# Altium schematic sheet PWRCTRL_RELAY_PWM_48V3A.SchDoc: Device Control Port
size A4; Organization: Altium Limited.; Address1: Level 3, 12a Rodborough Rd; Address2: Frenchs Forest 2086; Address3: NSW; Address4: AUSTRALIA; DocumentNumber: 1; Revision: 6; SheetNumber: 1; SheetTotal: 2
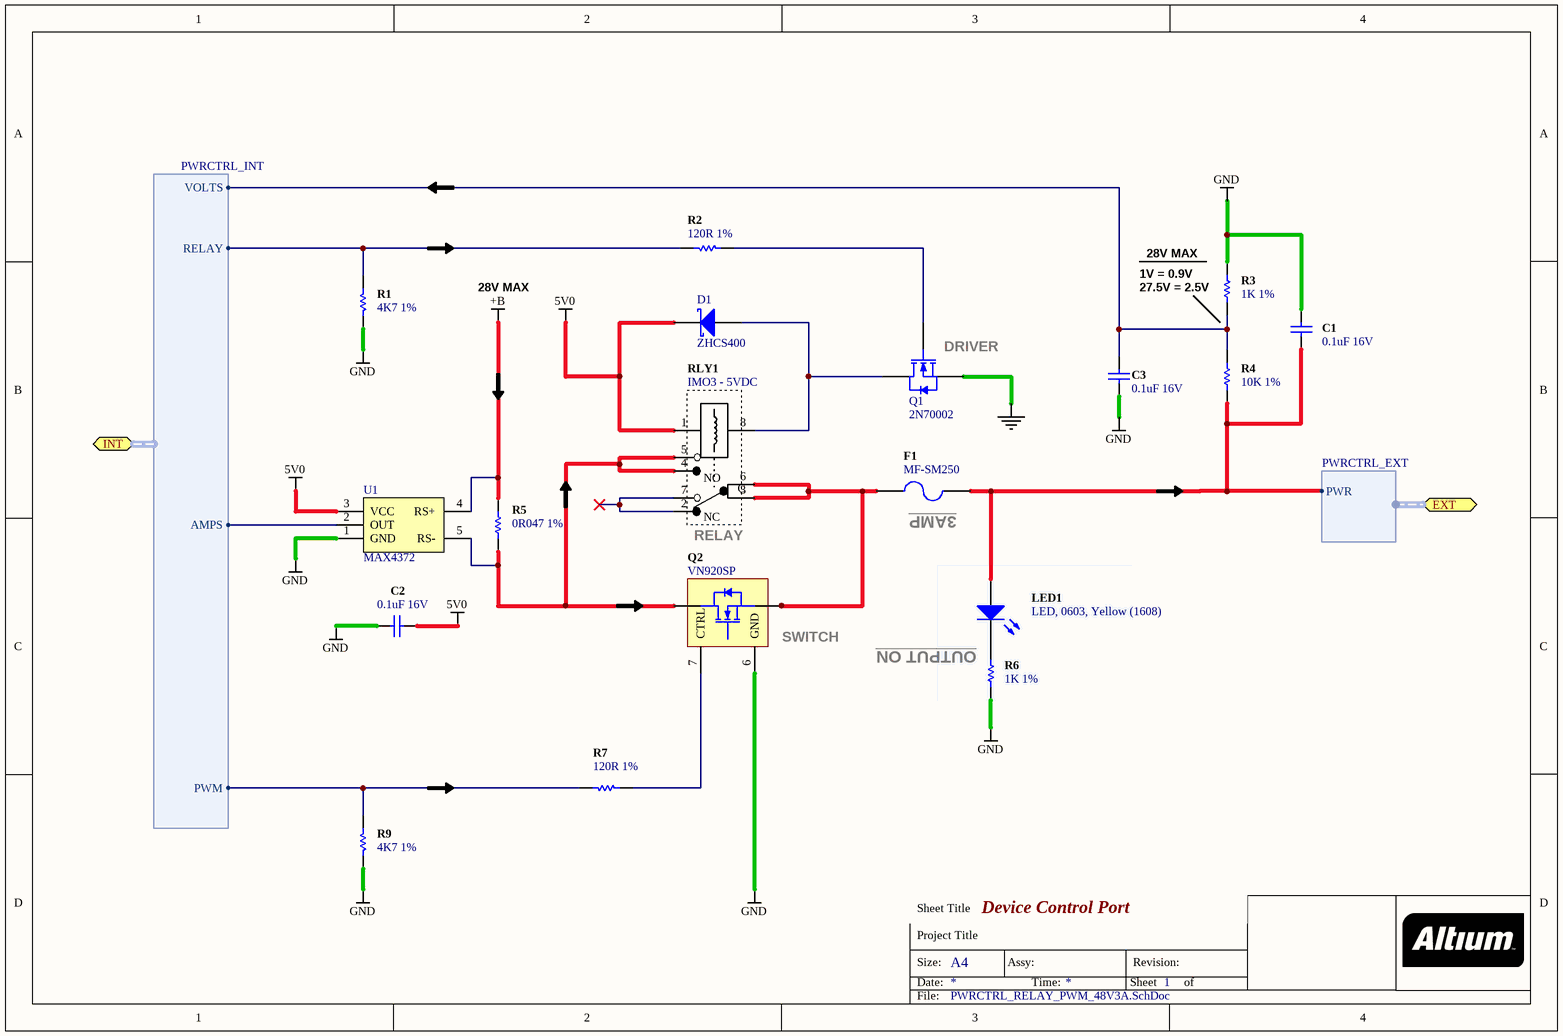
[diagram p0: PWRCTRL_RELAY_PWM_48V3A.SchDoc]

## Parts
C1  0.1uF 16V  [CAPC1005-STAR]
C2  0.1uF 16V  [CAPC1005-STAR]
C3  0.1uF 16V  [CAPC1005-STAR]
D1  ZHCS400  [SOD323]
F1  MF-SM250  [MF_SM250]
LED1  LED, 0603, Yellow (1608)  [0603LED]
Q1  2N70002  [SOT95P230-3D]
Q2  VN920SP  [PowerSO-10_M]
R1  4K7 1%  [RESC1005-STAR]
R2  120R 1%  [RESC1005-STAR]
R3  1K 1%  [RESC1005-STAR]
R4  10K 1%  [RESC1005-STAR]
R5  0R047 1%  [RESC3216]
R6  1K 1%  [RESC1005-STAR]
R7  120R 1%  [RESC1005-STAR]
R9  4K7 1%  [RESC1005-STAR]
RLY1  IMO3 - 5VDC  [IM03GR]
U1  MAX4372  [SOT-23-5]

## Blocks framed on the sheet
OUTPUT ON: LED1 R6

## Ports
EXT (harness PWRCTRL_EXT), INT (harness PWRCTRL_INT)

## Harnesses
PWRCTRL_INT: PWM, RELAY, VOLTS, AMPS
PWRCTRL_EXT: PWR

## Nets
5V0: C2.1 D1.2(K) RLY1.1 U1.3(VCC)
+B: R5.2 U1.4(RS+)
GND: C1.2 C2.2 C3.2 Q1.3(S) Q2.6(GND) R1.1 R3.1 R6.1 R9.1 U1.1(GND)
NetC1_1: C1.1 F1.2 LED1.1(A) R4.2 ; port EXT.PWR
NetC3_1: C3.1 R3.2 R4.1 ; port INT.VOLTS
NetD1_1: D1.1(A) Q1.2(D) RLY1.8
NetF1_1: F1.1 Q2.1(OUTPUT) Q2.2(OUTPUT) Q2.4(OUTPUT) Q2.5(OUTPUT) RLY1.3 RLY1.6
NetLED1_2: LED1.2(K) R6.2
NetQ1_1: Q1.1(G) R2.2
NetQ2_7: Q2.7(CTRL) R7.2
NetQ2_11: Q2.11(VCC) R5.1 RLY1.4 RLY1.5 U1.5(RS-)
NetR1_2: R1.2 R2.1 ; port INT.RELAY
NetR7_1: R7.1 R9.2 ; port INT.PWM
NetRLY1_2: RLY1.2 RLY1.7
NetU1_2: U1.2(OUT) ; port INT.AMPS

## Notes on the sheet
- 28V MAX
- (near R3) 1V = 0.9V
- (near R3) 27.5V = 2.5V
- (near R3) 28V MAX
- (near Q1) DRIVER
- (near F1) 3AMP
- (near RLY1) RELAY
- (near Q2) SWITCH
- Sheet Title
- Project Title
- Size:
- Date:
- A4
- Assy:
- Time:
- Sheet
- Revision:
- of
- File:
- (in symbol D-313-0001) NO; C; NC

## Library data of the parts
C1-C3 = D-101-0080: Capacitor, Ceramic, 0.1uF 10% 16V 0402 (1005) X7R; Polarity: Non-Polarized; Category: Capacitor; Capacitance: 0.1 uF; Dielectric: X7R; Mounting Technology: Surface Mount; Rated Voltage: 16 V; Status: Production; Technology: Ceramic; Tolerance: 10 %
D1 = D-151-0004: Schottky Diode, 400mA; Rated Voltage: mV; Max Forward Current: 400 mA; Mounting Technology: Surface Mount; Status: Unreleased; Category: Diode-Schottky
F1 = D-106-0000: Mutifuse, SMD 5A; Rated Voltage: mV; Amperage: 5 A; Category: Fuse
LED1 = D-153-0007: Brightness: 80 mcd; Color: Yellow/Amber; Peak Wave Length: nm; Category: LED; Mounting Technology: Surface Mount; Status: Production
Q1 = D-158-0002: N-channel Enhancement Mode Field-effect Transistor; Transistor Type: NPN; Mounting Technology: Surface Mount; Status: Unreleased; Category: Transistor-FET
Q2 = D-313-0000: Single Channel High Side SSR; Rated Voltage: mV; Switch Type: SPDT; Mounting Technology: Surface Mount; Status: Unreleased; Category: Relay
R1 R9 = D-100-0088: Resistor, 4K7 1% 0402 (1005); Power Rating: 63 mW; Resistance: 4.7 K; Category: Resistor; Mounting Technology: Surface Mount; Status: Production; Tolerance: 1 %
R2 R7 = D-100-0126: Resistor, 120R 1% 0402 (1005); Power Rating: 63 mW; Category: Resistor; Mounting Technology: Surface Mount; Resistance: 120 R; Status: Production; Tolerance: 1 %
R3 R6 = D-100-0121: Resistor, 1K 1% 0402 (1005); Power Rating: 63 mW; Category: Resistor; Mounting Technology: Surface Mount; Resistance: 1 K; Status: Production; Tolerance: 1 %
R4 = D-100-0130: Resistor, 10K 1% 0402 (1005); Power Rating: 63 mW; Category: Resistor; Mounting Technology: Surface Mount; Resistance: 10 K; Status: Production; Tolerance: 1 %
R5 = D-100-0007: Resistor, 0R047, LRC02P, SMD, 1206, Thick Film, Current Sense, 1%; Power Rating: mW; Resistance: 47 mR; Mounting Technology: Surface Mount; Status: Production; Tolerance: 1 %; Category: Resistor
RLY1 = D-313-0001: Relay, Tyco IM03GR; Rated Voltage: mV; Switch Type: SPDT; Mounting Technology: Surface Mount; Status: Unreleased; Category: Relay
U1 = D-204-0012: MAX4372 High Side Current Sense Amplifier; Max Input Voltage: mV; Max Output Current: mA; Max Output Voltage: mV; Min Input Voltage: mV; Min Output Voltage: mV; Mounting Technology: Surface Mount; Status: Production; Supply Voltage: mV; Category: IC-Power